# EAGLE design hat_v1 (EAGLE 9.0.1)
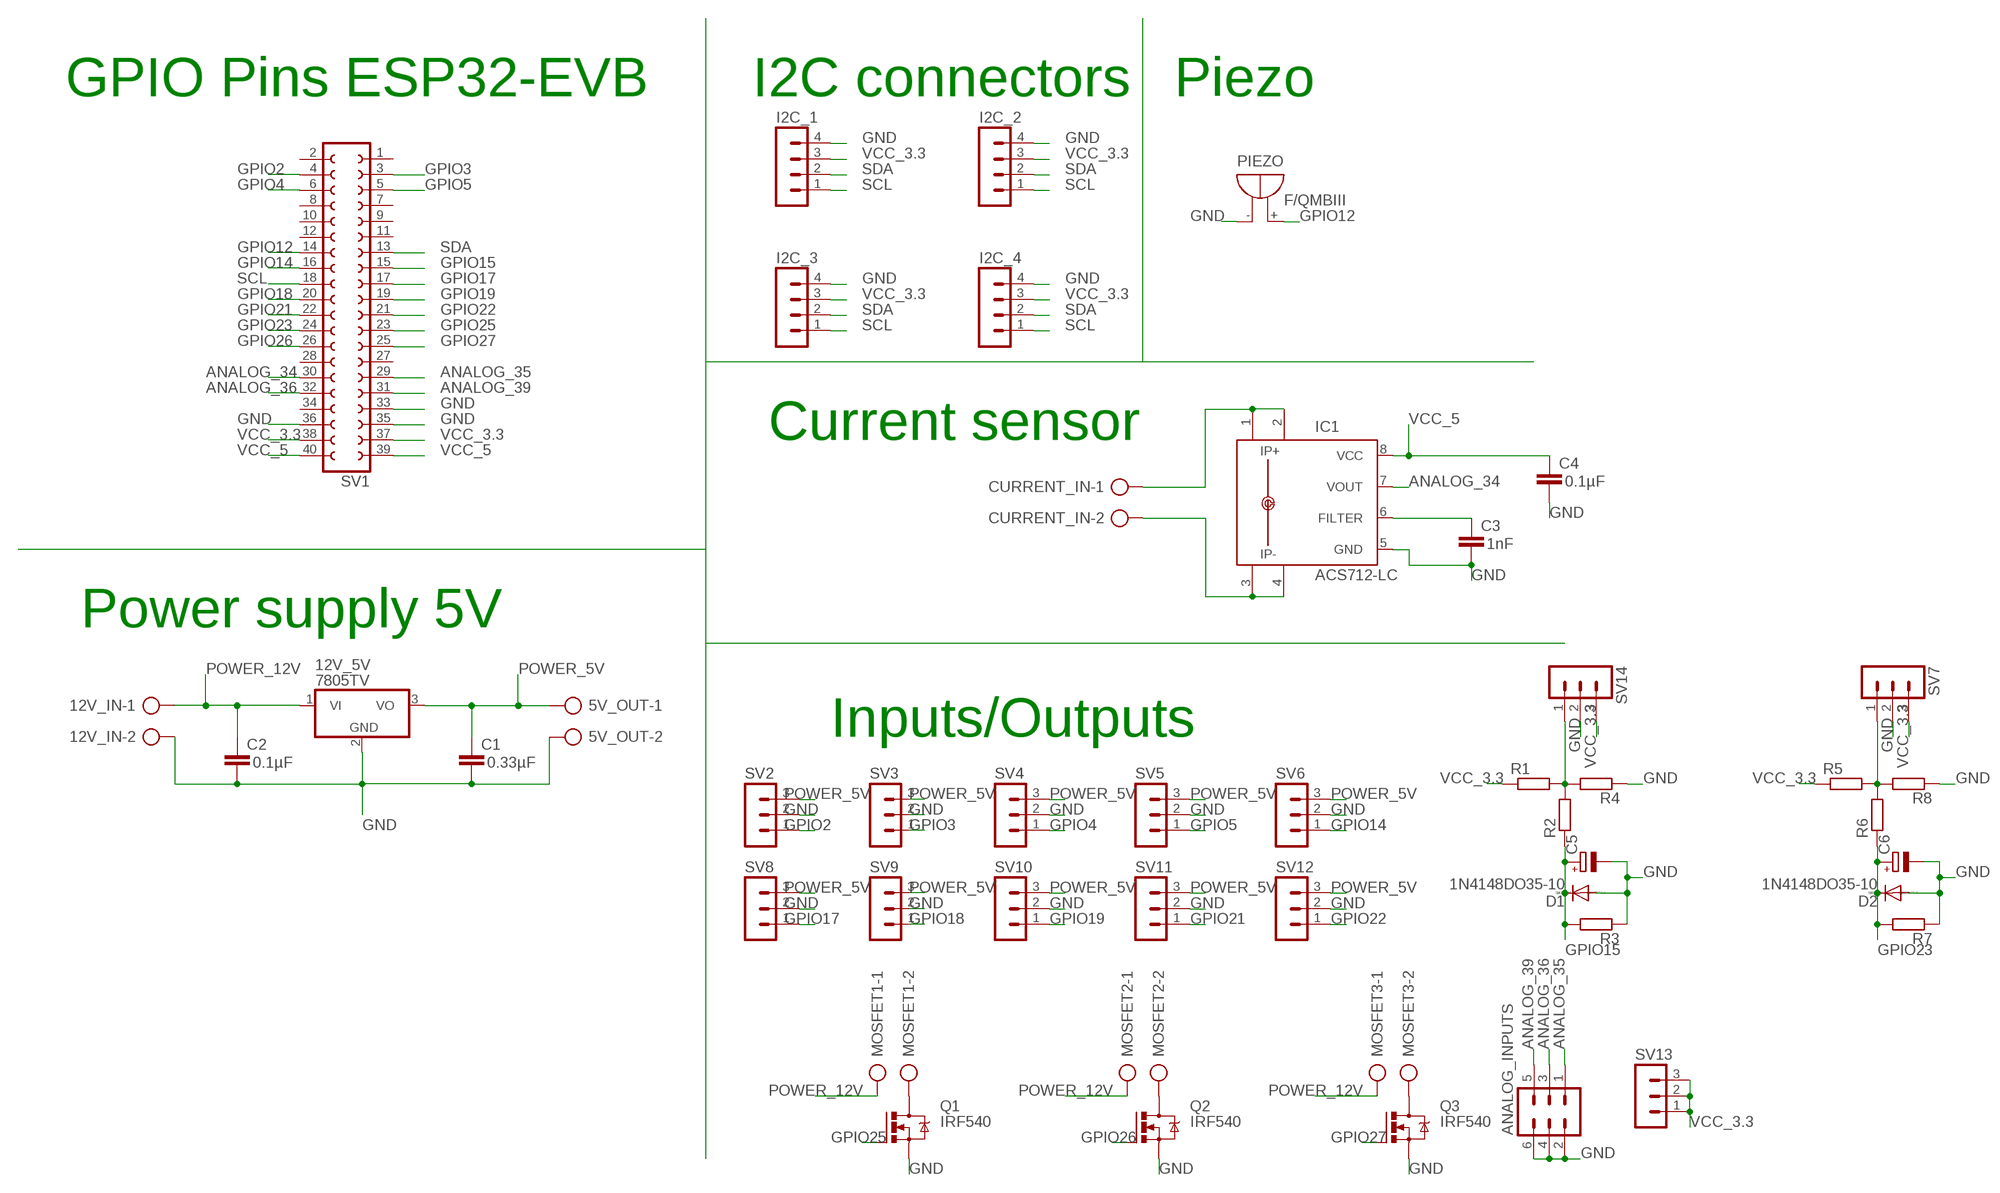
[diagram p0: schematic, sheet 1]

## Parts
5V_OUT  AK500/2  [AK500/2]
12V_5V  7805TV  [TO220V]
12V_IN  AK500/2  [AK500/2]
ANALOG_INPUTS  MA03-2  [MA03-2]
C1  C-EU050-050X075  [C050-050X075]
C2  C-EU050-035X075  [C050-035X075]
C3  C-EU025-025X050  [C025-025X050]
C4  C-EU025-025X050  [C025-025X050]
C5  CPOL-EUE2.5-6  [E2,5-6]
C6  CPOL-EUE2.5-6  [E2,5-6]
CURRENT_IN  AK500/2  [AK500/2]
D1  1N4148DO35-10  [DO35-10]
D2  1N4148DO35-10  [DO35-10]
I2C_1  MA04-1  [MA04-1]
I2C_2  MA04-1  [MA04-1]
I2C_3  MA04-1  [MA04-1]
I2C_4  MA04-1  [MA04-1]
IC1  ACS712-LC  [SOIC8]
MOSFET1  AK500/2  [AK500/2]
MOSFET2  AK500/2  [AK500/2]
MOSFET3  AK500/2  [AK500/2]
PIEZO  F/QMBIII  [F/QMBIII]
Q1  IRF540  [TO220BV]
Q2  IRF540  [TO220BV]
Q3  IRF540  [TO220BV]
R1  R-EU_0207/2V  [0207/2V]
R2  R-EU_0207/2V  [0207/2V]
R3  R-EU_0207/2V  [0207/2V]
R4  R-EU_0617/5V  [0617V]
R5  R-EU_0207/2V  [0207/2V]
R6  R-EU_0207/2V  [0207/2V]
R7  R-EU_0207/2V  [0207/2V]
R8  R-EU_0617/5V  [0617V]
SV1  FE20-2  [FE20-2]
SV2  MA03-1  [MA03-1]
SV3  MA03-1  [MA03-1]
SV4  MA03-1  [MA03-1]
SV5  MA03-1  [MA03-1]
SV6  MA03-1  [MA03-1]
SV7  MA03-1  [MA03-1]
SV8  MA03-1  [MA03-1]
SV9  MA03-1  [MA03-1]
SV10  MA03-1  [MA03-1]
SV11  MA03-1  [MA03-1]
SV12  MA03-1  [MA03-1]
SV13  MA03-1  [MA03-1]
SV14  MA03-1  [MA03-1]

## Nets
ANALOG_34: IC1.7(VOUT) SV1.30
ANALOG_35: ANALOG_INPUTS.1 SV1.29
ANALOG_36: ANALOG_INPUTS.3 SV1.32
ANALOG_39: ANALOG_INPUTS.5 SV1.31
GND: 5V_OUT.2 12V_5V.2(GND) 12V_IN.2 ANALOG_INPUTS.2 ANALOG_INPUTS.4 ANALOG_INPUTS.6 C1.2 C2.2 C3.2 C4.2 C5.- C6.- D1.A D2.A I2C_1.4 I2C_2.4 I2C_3.4 I2C_4.4 IC1.5(GND) PIEZO.-(+) Q1.S Q2.S Q3.S R3.1 R4.1 R7.1 R8.1 SV1.33 SV1.35 SV1.36 SV2.2 SV3.2 SV4.2 SV5.2 SV6.2 SV7.2 SV8.2 SV9.2 SV10.2 SV11.2 SV12.2 SV14.2
GPIO2: SV1.4 SV2.1
GPIO3: SV1.3 SV3.1
GPIO4: SV1.6 SV4.1
GPIO5: SV1.5 SV5.1
GPIO12: PIEZO.+(-) SV1.14
GPIO14: SV1.16 SV6.1
GPIO15: C5.+ D1.C R2.1 R3.2 SV1.15
GPIO17: SV1.17 SV8.1
GPIO18: SV1.20 SV9.1
GPIO19: SV1.19 SV10.1
GPIO21: SV1.22 SV11.1
GPIO22: SV1.21 SV12.1
GPIO23: C6.+ D2.C R6.1 R7.2 SV1.24
GPIO25: Q1.G SV1.23
GPIO26: Q2.G SV1.26
GPIO27: Q3.G SV1.25
N$4: MOSFET1.2 Q1.D
N$5: MOSFET2.2 Q2.D
N$6: MOSFET3.2 Q3.D
N$7: CURRENT_IN.1 IC1.1(IP+) IC1.2(IP+1)
N$8: CURRENT_IN.2 IC1.3(IP-) IC1.4(IP-1)
N$9: R1.2 R2.2 R4.2 SV14.1
N$10: R5.2 R6.2 R8.2 SV7.1
N$11: C3.1 IC1.6(FILTER)
POWER_5V: 5V_OUT.1 12V_5V.3(VO) C1.1 SV2.3 SV3.3 SV4.3 SV5.3 SV6.3 SV8.3 SV9.3 SV10.3 SV11.3 SV12.3
POWER_12V: 12V_5V.1(VI) 12V_IN.1 C2.1 MOSFET1.1 MOSFET2.1 MOSFET3.1
SCL: I2C_1.1 I2C_2.1 I2C_3.1 I2C_4.1 SV1.18
SDA: I2C_1.2 I2C_2.2 I2C_3.2 I2C_4.2 SV1.13
VCC_3.3: I2C_1.3 I2C_2.3 I2C_3.3 I2C_4.3 R1.1 R5.1 SV1.37 SV1.38 SV7.3 SV13.1 SV13.2 SV13.3 SV14.3
VCC_5: C4.1 IC1.8(VCC) SV1.39 SV1.40
Unconnected: SV1.1 SV1.2 SV1.7 SV1.8 SV1.9 SV1.10 SV1.11 SV1.12 SV1.27 SV1.28 SV1.34

## Notes on the sheet
- GPIO Pins ESP32-EVB | I2C connectors | Piezo
- Current sensor
- Power supply 5V
- Inputs/Outputs

## Library data of the parts
5V_OUT 12V_IN CURRENT_IN MOSFET1-MOSFET3 = con-ptr500:AK500/2: CONNECTOR; OC_FARNELL: unknown; OC_NEWARK: unknown
12V_5V = linear:78*: Positive VOLTAGE REGULATOR Source: http://cache.national.com/ds/LM/LM78L05.pdf http://www.fairchildsemi.com/ds/LM/LM7805.pdf
ANALOG_INPUTS = con-lstb:MA03-2: PIN HEADER; OC_FARNELL: unknown; OC_NEWARK: unknown
C1 = resistor:C-EU: CAPACITOR, European symbol; C1: 0.33µF
C2 = resistor:C-EU: CAPACITOR, European symbol; C2: 0.1µF
C3 = rcl:C-EU: CAPACITOR, European symbol; SPICEPREFIX: 1nF
C4 = rcl:C-EU: CAPACITOR, European symbol; SPICEPREFIX: 0.1µF
C5 C6 = rcl:CPOL-EU: POLARIZED CAPACITOR, European symbol; SPICEPREFIX: C
D1 D2 = diode:1N4148: DIODE high speed (Philips)
I2C_1-I2C_4 = con-lstb:MA04-1: PIN HEADER; OC_FARNELL: unknown; OC_NEWARK: unknown
IC1 = allegro-2:ACS712-LC
PIEZO = buzzer:F/QMBIII: BUZZER Source: Buerklin; OC_FARNELL: unknown; OC_NEWARK: unknown
Q1-Q3 = transistor-power:IRF540: HEXFET Power MOSFET
R1-R8 = rcl:R-EU_: RESISTOR, European symbol; SPICEPREFIX: R
SV1 = con-lsta:FE20-2: FEMALE HEADER; OC_FARNELL: unknown; OC_NEWARK: unknown
SV2 SV8 SV13 = con-lstb:MA03-1: PIN HEADER; OC_FARNELL: unknown; OC_NEWARK: unknown
SV3-SV7 SV9-SV12 SV14 = con-lstb:MA03-1: PIN HEADER; OC_FARNELL: unknown; OC_NEWARK: unknown; SPICEPREFIX: J

## Board
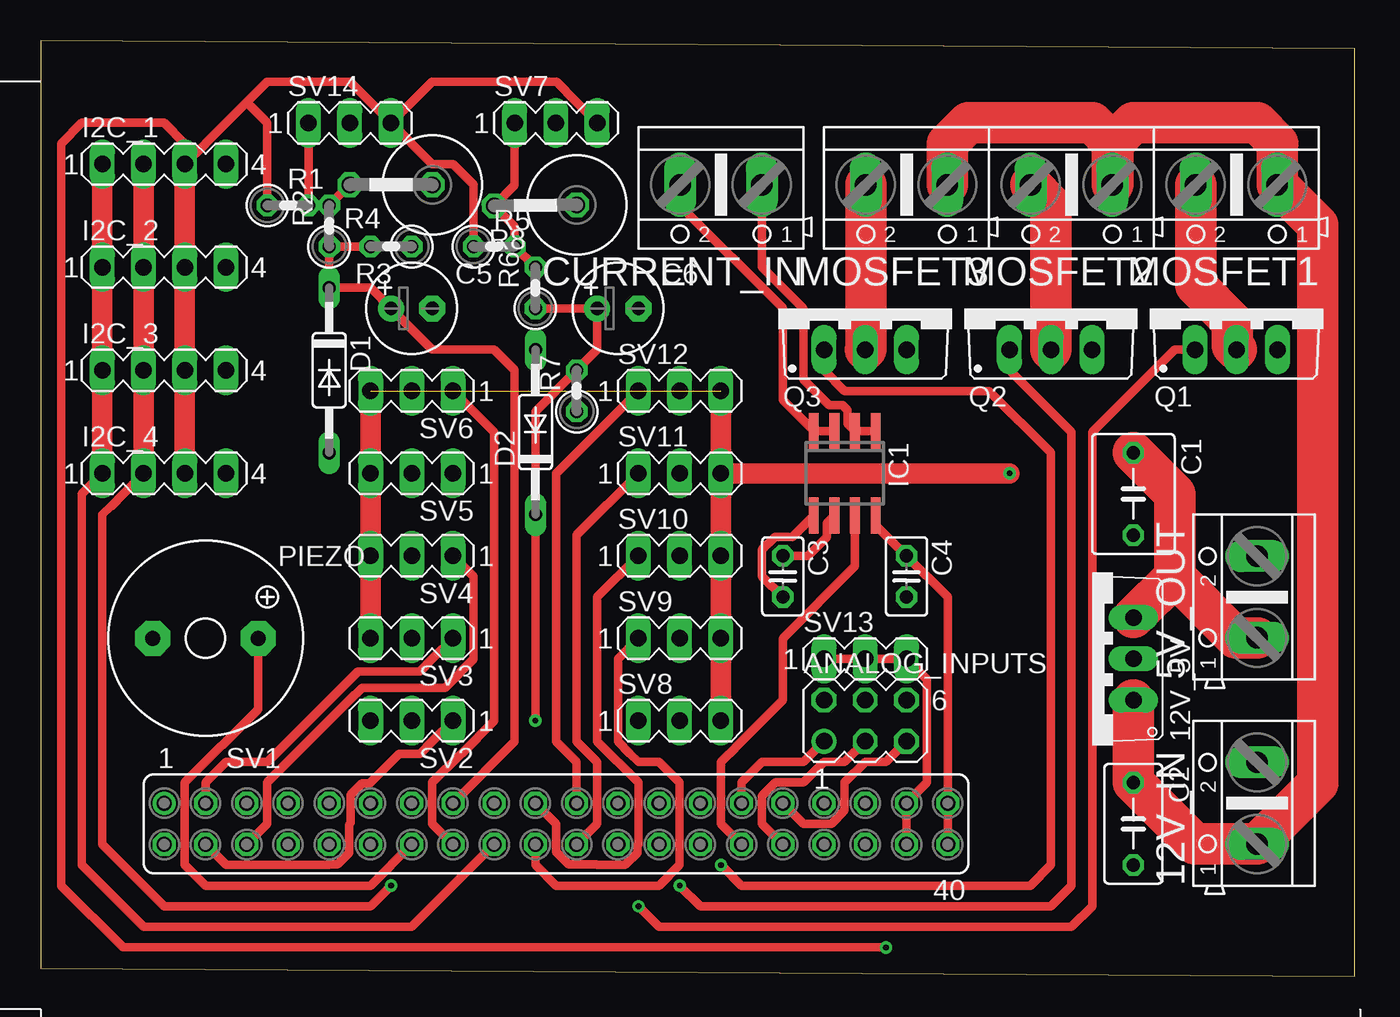
[diagram p1: board, top side]
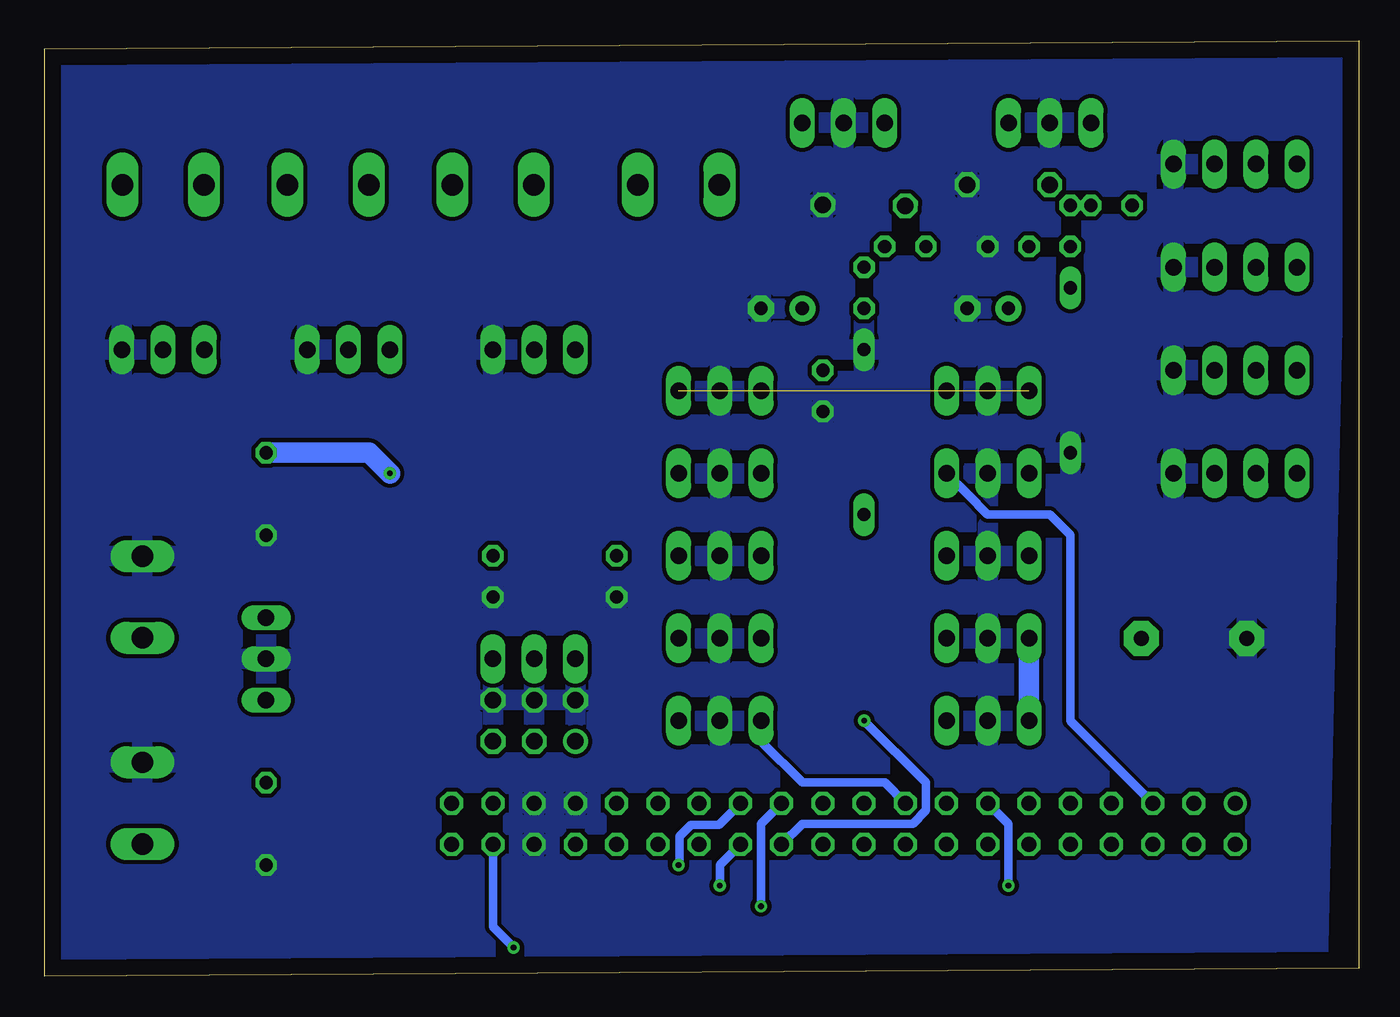
[diagram p2: board, bottom side, seen from below]

Size 80.95 x 57.65 mm. Coordinates in mm from the lower left corner, seen from the top.
Outline: 0,0.51 80.95,0 80.95,57.14 0,57.65 0,0.51
Copper layers (1*16): Top 0.035mm / dielectric 1.5mm / Bottom 0.035mm
Design rules "default *": minimum track width 6mil, minimum drill 0.35mm, track to track 10mil, track to pad 10mil, pad to pad 10mil, via to via 10mil, smd to smd 10mil, copper to edge 40mil, drill to drill 6mil, minimum pad ring 10mil, minimum via ring 8mil, stop-mask expansion 4mil, vias tented up to drill 0mil, thermal gap 10mil

### Footprints (pad centres in the part's own frame; a part is rotated, then mirrored left to right if it is on the bottom)
AK500/2 = drill 1.321 long: 1 -2.515,0; 2 2.515,0
TO220V = drill 1.016 long: 1 -2.54,-2.54; 2 0,-2.54; 3 2.54,-2.54
MA03-2 = drill 1.016: 1 -2.54,-1.27 | drill 1.016 octagon: 2 -2.54,1.27; 3 0,-1.27; 4 0,1.27; 5 2.54,-1.27; 6 2.54,1.27
C050-050X075 = drill 0.813 octagon: 1 -2.54,0; 2 2.54,0
C050-035X075 = drill 0.813 octagon: 1 -2.54,0; 2 2.54,0
C025-025X050 = drill 0.813 octagon: 1 -1.27,0; 2 1.27,0
E2,5-6 = drill 0.813 pad 1.6: + -1.27,0 | drill 0.813 pad 1.6 octagon: - 1.27,0
DO35-10 = drill 0.813 long: A 5.08,0; C -5.08,0
MA04-1 = drill 1.016 long: 1 -3.81,0; 2 -1.27,0; 3 1.27,0; 4 3.81,0
SOIC8 = smd 0.6 x 2.2: 1 -1.905,-2.6; 2 -0.635,-2.6; 3 0.635,-2.6; 4 1.905,-2.6; 5 1.905,2.6; 6 0.635,2.6; 7 -0.635,2.6; 8 -1.905,2.6
F/QMBIII = drill 0.914 pad 2.159 octagon: + 3.251,0; - -3.251,0
TO220BV = drill 1.016 long: D 0,-2.54; G -2.54,-2.54; S 2.54,-2.54
0207/2V = drill 0.813 octagon: 1 -1.27,0; 2 1.27,0
0617V = drill 1.016 octagon: 1 -2.54,0; 2 2.54,0
FE20-2 = drill 0.914: 1 -24.13,1.27 | drill 0.914 octagon: 2 -24.13,-1.27; 3 -21.59,1.27; 4 -21.59,-1.27; 5 -19.05,1.27; 6 -19.05,-1.27; 7 -16.51,1.27; 8 -16.51,-1.27; 9 -13.97,1.27; 10 -13.97,-1.27; 11 -11.43,1.27; 12 -11.43,-1.27; 13 -8.89,1.27; 14 -8.89,-1.27; 15 -6.35,1.27; 16 -6.35,-1.27; 17 -3.81,1.27; 18 -3.81,-1.27; 19 -1.27,1.27; 20 -1.27,-1.27; 21 1.27,1.27; 22 1.27,-1.27; 23 3.81,1.27; 24 3.81,-1.27; 25 6.35,1.27; 26 6.35,-1.27; 27 8.89,1.27; 28 8.89,-1.27; 29 11.43,1.27; 30 11.43,-1.27; 31 13.97,1.27; 32 13.97,-1.27; 33 16.51,1.27; 34 16.51,-1.27; 35 19.05,1.27; 36 19.05,-1.27; 37 21.59,1.27; 38 21.59,-1.27; 39 24.13,1.27; 40 24.13,-1.27
MA03-1 = drill 1.016 long: 1 -2.54,0; 2 0,0; 3 2.54,0

### Placement (x,y rotation side)
5V_OUT  74.93,23.37 90 top
12V_5V  64.77,19.56 90 top
12V_IN  74.93,10.67 90 top
ANALOG_INPUTS  50.8,15.75 0 top
C1  67.31,29.72 270 top
C2  67.31,9.4 270 top
C3  45.72,24.64 270 top
C4  53.34,24.64 270 top
C5  22.86,41.15 0 top
C6  35.56,41.15 0 top
CURRENT_IN  41.91,48.77 180 top
D1  17.78,37.34 270 top
D2  30.48,33.53 90 top
I2C_1  7.62,50.04 0 top
I2C_2  7.62,43.69 0 top
I2C_3  7.62,37.34 0 top
I2C_4  7.62,30.99 0 top
IC1  49.53,30.99 180 top
MOSFET1  73.66,48.77 180 top
MOSFET2  63.5,48.77 180 top
MOSFET3  53.34,48.77 180 top
PIEZO  10.16,20.83 0 top
Q1  73.66,41.15 0 top
Q2  62.23,41.15 0 top
Q3  50.8,41.15 0 top
R1  15.24,47.5 0 top
R2  17.78,46.23 90 top
R3  21.59,44.96 180 top
R4  21.59,48.77 180 top
R5  27.94,44.96 0 top
R6  30.48,42.42 90 top
R7  33.02,36.07 90 top
R8  30.48,47.5 180.8 top
SV1  31.75,9.4 0 top
SV2  22.86,15.75 180 top
SV3  22.86,20.83 180 top
SV4  22.86,25.91 180 top
SV5  22.86,30.99 180 top
SV6  22.86,36.07 180 top
SV7  31.75,52.58 0 top
SV8  39.37,15.75 0 top
SV9  39.37,20.83 0 top
SV10  39.37,25.91 0 top
SV11  39.37,30.99 0 top
SV12  39.37,36.07 0 top
SV13  50.8,19.56 0 top
SV14  19.05,52.58 0 top

### Tracks (layer width: path | path; a pad name or v marks a point on that pad's centre or on a via)
ANALOG_34
  Top 0.508: SV1.30 41.91,9.4 41.91,13.21 42.42,13.72 42.44,13.72 43.18,14.46 43.18,14.48 45.72,17.02 45.72,20.83 50.16,25.27 IC1.7
ANALOG_35
  Top 0.508: ANALOG_INPUTS.1 46.99,13.21 44.45,13.21 43.18,11.94 SV1.29
ANALOG_36
  Top 0.508: SV1.32 44.45,9.4 44.45,11.12 45.27,11.94 46.99,11.94 48.26,13.21 49.53,13.21 ANALOG_INPUTS.3
ANALOG_39
  Top 0.508: SV1.31 46.99,9.4 48.71,9.4 49.53,10.21 49.53,11.94 50.8,13.21 52.07,13.21 ANALOG_INPUTS.5
GND
  Top 0.508: C3.2 44.45,24.64 44.45,26.29 45.24,27.08 46.31,27.08 IC1.5
  pour Bottom: 1.27,56.39 2.54,0.51 81.28,0.51 80.01,56.39
GPIO2
  Top 0.508: SV1.4 11.43,6.86 17.78,6.86 17.83,6.91 18.29,6.91 19,7.62 19,9.35 19.1,9.45 19.1,11.17 19.82,11.89 20.27,11.89 22.1,13.72 23.39,13.72 24.13,14.46 24.13,14.48 SV2.1
GPIO3
  Top 0.508: SV1.3 10.16,11.94 11.43,13.21 13.99,13.21 15.24,14.46 15.24,14.48 19.56,18.8 23.39,18.8 24.13,19.54 24.13,19.56 SV3.1
GPIO4
  Top 0.508: SV4.1 26.67,24.64 26.67,19.54 24.91,17.78 19.79,17.78 19.05,17.04 19.05,17.02 13.97,11.94 13.97,9.4 SV1.6
GPIO5
  Bottom 0.508: SV5.1 24.13,29.72 24.13,29.7 22.88,28.45 19.05,28.45 17.78,27.18 17.78,15.75 SV1.5
GPIO12
  Top 0.508: SV1.14 20.32,5.59 10.16,5.59 8.89,6.86 8.89,11.94 13.41,16.46 PIEZO.+
GPIO14
  Top 0.508: SV6.1 27.94,33.53 27.94,15.73 25.93,13.72 25.91,13.72 24.13,11.94 24.13,9.4 SV1.16
GPIO15
  Top 0.508: SV1.15 29.21,14.48 29.21,37.34 27.94,38.61 24.13,38.61 C5.+ 20.32,42.42 D1.C R2.1 R3.2
GPIO17
  Bottom 0.508: SV1.17 29.21,11.94 34.29,11.94 36.83,14.48 SV8.1
GPIO18
  Top 0.508: SV9.1 35.56,19.56 35.56,14.46 36.3,13.72 36.32,13.72 36.83,13.21 38.1,13.21 39.37,11.94 39.37,6.86 38.1,5.59 31.75,5.59 30.48,6.86 SV1.20
GPIO19
  Top 0.508: SV1.19 31.75,9.4 31.75,7.67 32.52,6.91 34.24,6.91 34.29,6.86 36.01,6.86 36.78,7.62 36.78,8.08 36.83,8.13 36.83,11.94 34.29,14.48 34.29,23.37 SV10.1
GPIO21
  Top 0.508: SV1.22 34.29,9.4 34.29,13.21 33.02,14.48 33.02,27.18 SV11.1
GPIO22
  Top 0.508: SV1.21 33.02,13.21 31.75,14.48 31.75,30.99 SV12.1
GPIO23  (via drill 0.35)
  Top 0.508: v30.48,15.75 D2.C 30.48,34.8 R7.2 34.29,38.61 C6.+ R6.1
  Bottom 0.508: SV1.24 34.29,9.4 27.49,9.4 26.67,10.21 26.67,11.94 v30.48,15.75
GPIO25  (via drill 0.35)
  Top 0.508: v36.83,4.32 38.1,3.05 63.5,3.05 64.77,4.32 64.77,33.53 69.85,38.61 Q1.G
  Bottom 0.508: SV1.23 36.83,9.4 v36.83,4.32
GPIO26  (via drill 0.35)
  Top 0.508: v39.37,5.59 40.64,4.32 62.23,4.32 63.5,5.59 63.5,33.53 59.69,37.34 Q2.G
  Bottom 0.508: SV1.26 39.37,6.86 v39.37,5.59
GPIO27  (via drill 0.35)
  Top 0.508: v41.91,6.86 43.18,5.59 60.96,5.59 62.23,6.86 62.23,32.26 58.42,36.07 49.53,36.07 48.26,37.34 Q3.G
  Bottom 0.508: SV1.25 39.42,9.35 41.15,9.35 41.86,8.63 41.86,6.91 v41.91,6.86
N$4
  Top 2.54: Q1.D 73.41,38.86 73.41,40.32 71.14,42.58 MOSFET1.2
N$5
  Top 2.54: Q2.D 62.23,47.52 MOSFET2.2
N$6
  Top 2.54: Q3.D 50.83,38.63 MOSFET3.2
N$7
  Top 0.508: IC1.1 IC1.2 49.7,34.05 49.7,34.9 49.41,35.2 48.56,35.2 46.99,36.76 46.99,41.15 44.45,43.69 44.45,48.74 CURRENT_IN.1
N$8
  Top 0.508: IC1.3 IC1.4 45.72,35.49 45.72,41.17 39.4,47.49 CURRENT_IN.2
N$9
  Top 0.508: SV14.1 R1.2 R2.2 R4.2
N$10
  Top 0.508: R6.2 R5.2 29.21,46.19 R8.2 29.21,48.73 SV7.1
N$11
  Top 0.508: C3.1 47.26,25.91 48.43,27.08 48.43,27.93 IC1.6
POWER_5V  (via drill 0.35)  (1 unrouted)
  Top 1.27: SV6.3 SV5.3 SV4.3 SV3.3 | SV12.3 SV11.3 | SV11.3 SV10.3 SV9.3 SV8.3 | SV11.3 v59.69,30.99
  Top 2.54: 12V_5V.3 69.85,24.64 | 69.85,24.64 69.85,29.72 C1.1 | 5V_OUT.1 73.64,20.85 69.85,24.64
  Bottom 1.27: SV2.3 SV3.3 | v59.69,30.99 60.96,32.26 C1.1
POWER_12V
  Top 2.54: 12V_5V.1 C2.1 71.09,8.15 12V_IN.1 78.66,11.89 78.66,46.28 MOSFET1.1 76.17,51.28 76.2,51.31 74.93,52.58 67.31,52.58 66.04,51.31 66.04,48.79 MOSFET2.1 66.02,51.33 64.77,52.58 57.15,52.58 55.85,51.28 MOSFET3.1
SCL
  Top 0.508: SV1.18 22.86,3.05 6.35,3.05 2.54,6.86 2.54,29.72 I2C_4.1
  Top 1.27: I2C_1.1 I2C_2.1 I2C_3.1 I2C_4.1
SDA  (via drill 0.35)
  Top 0.254: I2C_3.2 6.35,36.07
  Top 0.508: v21.59,5.59 20.32,4.32 7.62,4.32 3.81,8.13 3.81,28.45 4.32,28.96 4.34,28.96 5.08,29.7 5.08,29.72 I2C_4.2
  Top 1.27: I2C_1.2 I2C_2.2 I2C_3.2 I2C_4.2
  Bottom 0.508: SV1.13 21.59,9.4 v21.59,5.59
VCC_3.3  (via drill 0.35)
  Top 0.508: SV1.38 SV1.37 54.61,11.94 54.61,18.29 SV13.3 SV13.2 SV13.1 | 12.7,53.85 10.92,52.07 10.9,52.07 10.16,51.33 10.16,51.31 I2C_1.3 8.89,51.31 7.62,52.58 2.54,52.58 1.27,51.31 1.27,5.59 5.08,1.78 v52.07,1.78 | 12.7,53.85 13.97,55.12 19.07,55.12 20.32,53.87 20.32,53.85 SV14.3 | 12.7,53.85 13.97,52.58 R1.1 | SV14.3 24.13,55.12 31.77,55.12 33.02,53.87 33.02,53.85 SV7.3 | R5.1 26.67,47.47 26.66,47.97 26.67,47.98 26.67,48.77 25.4,50.04 24.13,50.04 SV14.3
  Top 1.27: I2C_1.3 I2C_2.3 I2C_3.3 I2C_4.3
  Bottom 0.508: SV1.38 53.34,3.05 v52.07,1.78
VCC_5
  Top 0.508: SV1.40 SV1.39 55.88,23.37 C4.1 51.44,27.81 IC1.8